# Altium schematic sheet guitar_tuner.SchDoc
size Letter
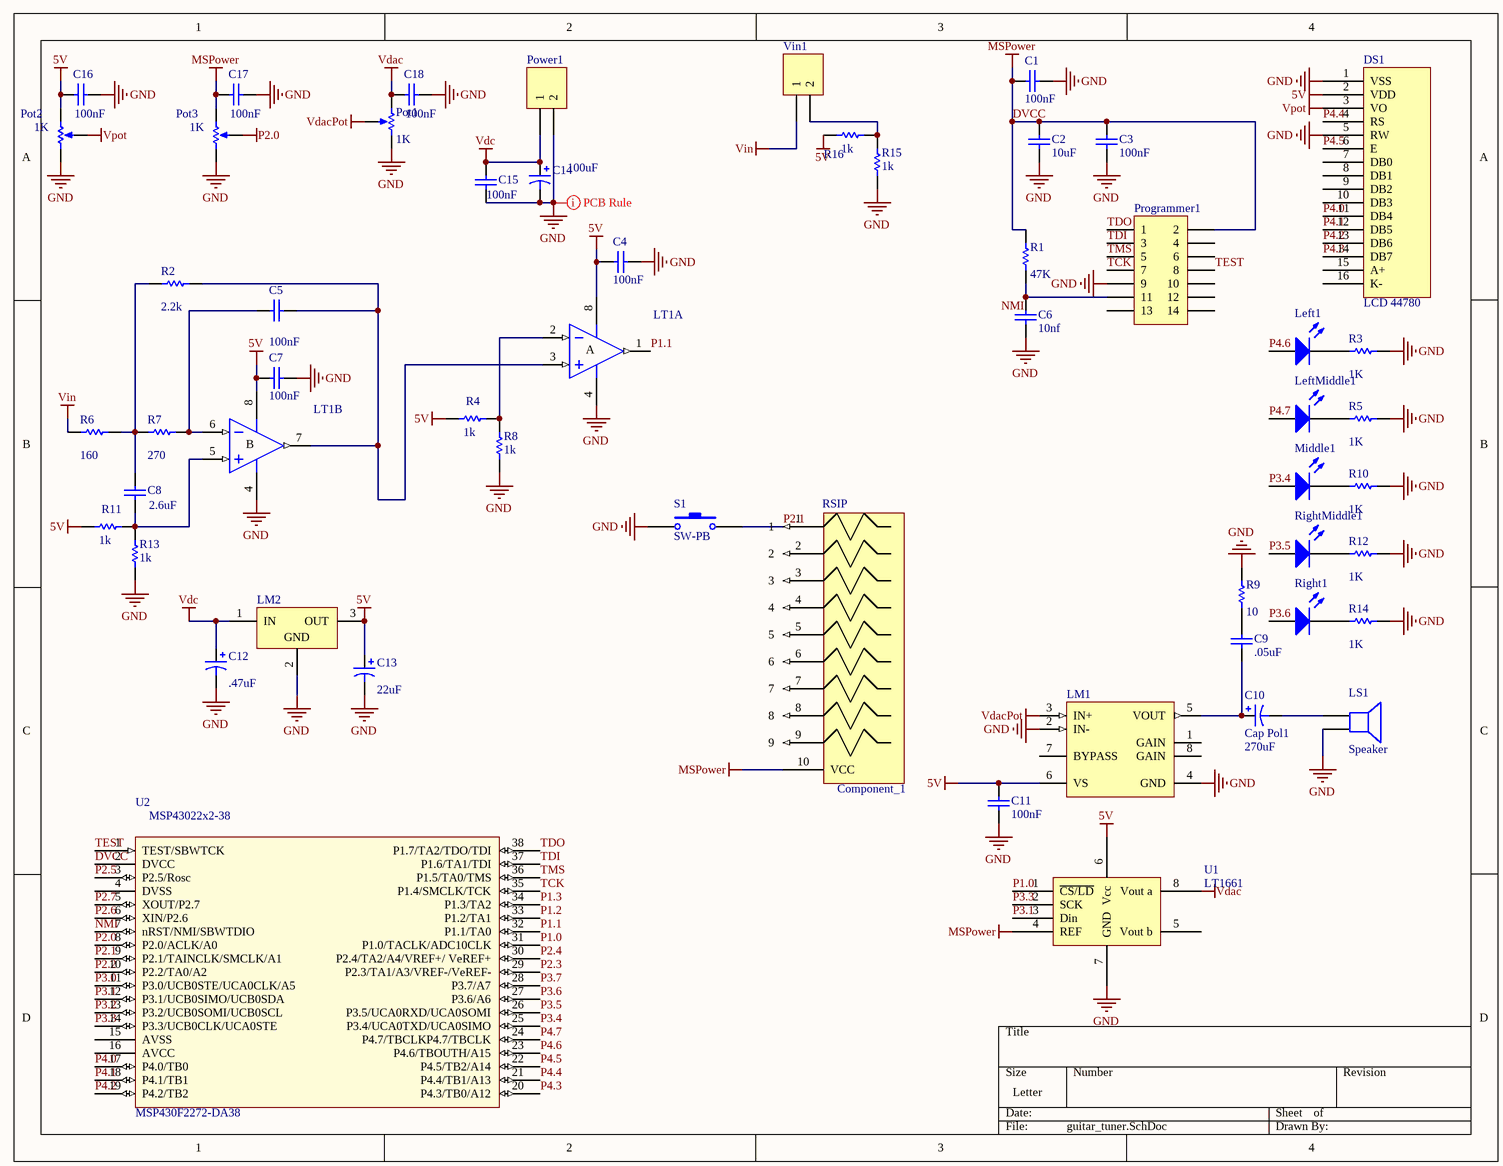
[diagram p0: guitar_tuner.SchDoc]

## Parts
C1  value 100nF  [RAD-0.1]  (hidden comment: Cap)
C2  value 10uF  [RAD-0.1]  (hidden comment: Cap)
C3  value 100nF  [RAD-0.1]  (hidden comment: Cap)
C4  value 100nF  [RAD-0.1]  (hidden comment: Cap)
C5  value 100nF  [RAD-0.1]  (hidden comment: Cap)
C6  value 10nf  [RAD-0.1]  (hidden comment: Cap)
C7  value 100nF  [RAD-0.1]  (hidden comment: Cap)
C8  value 2.6uF  [RAD-0.1]  (hidden comment: Cap)
C9  value .05uF  [RAD-0.1]  (hidden comment: Cap)
C10  Cap Pol1  value 270uF  [CAPR5-4X5]
C11  value 100nF  [RAD-0.1]  (hidden comment: Cap)
C12  value .47uF  [CAPR5-4X5]  (hidden comment: Cap Pol1)
C13  value 22uF  [CAPR5-4X5]  (hidden comment: Cap Pol1)
C14  value 100uF  [CAPR5-4X5]  (hidden comment: Cap Pol1)
C15  value 100nF  [RAD-0.1]  (hidden comment: Cap)
C16  value 100nF  [RAD-0.1]  (hidden comment: Cap)
C17  value 100nF  [RAD-0.1]  (hidden comment: Cap)
C18  value 100nF  [RAD-0.1]  (hidden comment: Cap)
DS1  LCD 44780  [OLED 16x2]
Left1  LED1  [LED-1]  (value not drawn)
LeftMiddle1  LED1  [LED-1]  (value not drawn)
LM1  LM386N-1  [N08E]  (value not drawn)
LM2  LM330KC  [KC03]  (value not drawn)
LS1  Speaker  [PIN2]
LT1  LF353P  [P008]  (value not drawn)  (parts A,B of 2)
Middle1  LED1  [LED-1]  (value not drawn)
Pot1  value 1K  [VR5]  (hidden comment: RPot)
Pot2  value 1K  [VR5]  (hidden comment: RPot)
Pot3  value 1K  [VR5]  (hidden comment: RPot)
Power1  Power  [HDR1X2]  (value not drawn)
Programmer1  Header 7X2  [HDR2X7]  (value not drawn)
R1  value 47K  [AXIAL-0.3]  (hidden comment: Res1)
R2  value 2.2k  [AXIAL-0.3]  (hidden comment: Res1)
R3  value 1K  [AXIAL-0.3]  (hidden comment: Res1)
R4  value 1k  [AXIAL-0.3]  (hidden comment: Res1)
R5  value 1K  [AXIAL-0.3]  (hidden comment: Res1)
R6  value 160  [AXIAL-0.3]  (hidden comment: Res1)
R7  value 270  [AXIAL-0.3]  (hidden comment: Res1)
R8  value 1k  [AXIAL-0.3]  (hidden comment: Res1)
R9  value 10  [AXIAL-0.3]  (hidden comment: Res1)
R10  value 1K  [AXIAL-0.3]  (hidden comment: Res1)
R11  value 1k  [AXIAL-0.3]  (hidden comment: Res1)
R12  value 1K  [AXIAL-0.3]  (hidden comment: Res1)
R13  value 1k  [AXIAL-0.3]  (hidden comment: Res1)
R14  value 1K  [AXIAL-0.3]  (hidden comment: Res1)
R15  value 1k  [AXIAL-0.3]  (hidden comment: Res1)
R16  value 1k  [AXIAL-0.3]  (hidden comment: Res1)
Right1  LED1  [LED-1]  (value not drawn)
RightMiddle1  LED1  [LED-1]  (value not drawn)
RSIP  Component_1  [LTC1661]
S1  SW-PB  [SW PB]
U1  LT1661  [DIP-8]
U2  MSP430F2272-DA38  [DIP38]
Vin1  GuitarIn  [HDR1X2]  (value not drawn)

## Nets
5V: C4.2 C7.1 C11.1 C13.1 C16.1 DS1.2(VDD) LM1.6(VS) LM2.3(OUT) LT1.8(V+) Pot2.1(TOP) R4.1 R11.1 R16.1 U1.6(Vcc)
DVCC: C1.2 C2.1 C3.1 C17.1 Pot3.3(TAP) Programmer1.2 R1.2 RSIP.10(VCC) U1.4(REF) U2.2(DVCC)  [also labelled MSPower]
GND: C1.1 C2.2 C3.2 C4.1 C6.2 C7.2 C11.2 C12.2 C13.2 C14.2 C15.1 C16.2 C17.2 C18.2 DS1.1(VSS) DS1.5(RW) LM1.2(IN-) LM1.4(GND) LM2.2(GND) LS1.2 LT1.4(V-) Pot1.2(BOT) Pot2.3(TAP) Pot3.1(TOP) Power1.2 Programmer1.9 R3.2 R5.2 R8.1 R9.2 R10.2 R12.2 R13.1 R14.2 R15.1 S1.1 U1.7(GND)
P2.0: Pot3.2(BOT) U2.8(P2.0/ACLK/A0)
Vdac: C18.1 Pot1.1(TOP) U1.8(Vout_a)
VdacPot: LM1.3(IN+) Pot1.3(TAP)
Vdc: C12.1 C14.1 C15.2 LM2.1(IN) Power1.1
Vin: R6.1 Vin1.1
Vpot: DS1.3(VO) Pot2.2(BOT)
NMI: C6.1 Programmer1.11 R1.1 U2.7(nRST/NMI/SBWTDIO)
P1.0: U1.1(~{CS/LD}) U2.31(P1.0/TACLK/ADC10CLK)
P1.1: LT1.1(OUT) U2.32(P1.1/TA0)
P1.2: U2.33(P1.2/TA1)
P1.3: U2.34(P1.3/TA2)
P2.1: S1.2 U2.9(P2.1/TAINCLK/SMCLK/A1)
P2.2: U2.10(P2.2/TA0/A2)
P2.3: U2.29(P2.3/TA1/A3/VREF-/VeREF-)
P2.4: U2.30(P2.4/TA2/A4/VREF+/_VeREF+)
P2.5: U2.3(P2.5/Rosc)
P2.6: U2.6(XIN/P2.6)
P2.7: U2.5(XOUT/P2.7)
P3.0: U2.11(P3.0/UCB0STE/UCA0CLK/A5)
P3.1: U1.3(Din) U2.12(P3.1/UCB0SIMO/UCB0SDA)
P3.2: U2.13(P3.2/UCB0SOMI/UCB0SCL)
P3.3: U1.2(SCK) U2.14(P3.3/UCB0CLK/UCA0STE)
P3.4: Middle1.1(A) U2.25(P3.4/UCA0TXD/UCA0SIMO)
P3.5: RightMiddle1.1(A) U2.26(P3.5/UCA0RXD/UCA0SOMI)
P3.6: Right1.1(A) U2.27(P3.6/A6)
P3.7: U2.28(P3.7/A7)
P4.0: DS1.11(DB4) U2.17(P4.0/TB0)
P4.1: DS1.12(DB5) U2.18(P4.1/TB1)
P4.2: DS1.13(DB6) U2.19(P4.2/TB2)
P4.3: DS1.14(DB7) U2.20(P4.3/TB0/A12)
P4.4: DS1.4(RS) U2.21(P4.4/TB1/A13)
P4.5: DS1.6(E) U2.22(P4.5/TB2/A14)
P4.6: Left1.1(A) U2.23(P4.6/TBOUTH/A15)
P4.7: LeftMiddle1.1(A) U2.24(P4.7/TBCLKP4.7/TBCLK)
TCK: Programmer1.7 U2.35(P1.4/SMCLK/TCK)
TDI: Programmer1.3 U2.37(P1.6/TA1/TDI)
TDO: Programmer1.1 U2.38(P1.7/TA2/TDO/TDI)
TEST: Programmer1.8 U2.1(TEST/SBWTCK)
TMS: Programmer1.5 U2.36(P1.5/TA0/TMS)
NetC5_1: C5.1 LT1.6(IN-) R7.2
NetC5_2: C5.2 LT1.3(IN+) LT1.7(OUT) R2.2
NetC8_1: C8.1 LT1.5(IN+) R11.2 R13.2
NetC8_2: C8.2 R2.1 R6.2 R7.1
NetC9_1: C9.1 R9.1
NetC9_2: C9.2 C10.1 LM1.5(VOUT)
NetC10_2: C10.2 LS1.1
NetLeft1_2: Left1.2(K) R3.1
NetLeftMiddle1_2: LeftMiddle1.2(K) R5.1
NetLT1_2: LT1.2(IN-) R4.2 R8.2
NetMiddle1_2: Middle1.2(K) R10.1
NetR12_1: R12.1 RightMiddle1.2(K)
NetR14_1: R14.1 Right1.2(K)
NetR15_2: R15.2 R16.2 Vin1.2

Not connected (* = marked no-connect by the designer): DS1 7(DB0) 8(DB1) 9(DB2) 10(DB3) 15(A+) 16(K-); LM1 1(GAIN) 7(BYPASS) 8(GAIN); Programmer1 4 6 10 12 13 14; RSIP 1 2 3 4 5 6 7 8 9; U1 5(Vout_b); U2 4(DVSS) 15(AVSS) 16(AVCC)

## Layout directives
rule Width Constraint [Pref Width = 25mil    Min Width = 20mil    Max Width = 30mil]: GND

## Notes on the sheet
- (in symbol LF353P, part A) A
- (in symbol LF353P, part B) B
- (in symbol MSP430F22x2-DA38) MSP43022x2-38

## Library data of the parts
C1-C9 C11 C15-C18 = Cap: Capacitor; Published: 8-Jun-2000; LatestRevisionDate: 17-Jul-2002; LatestRevisionNote: Re-released for DXP Platform.; PackageReference: RAD-0.3; Publisher: Altium Limited; PackageDescription: Radial Cap, Thru-Hole; 2 Leads; 0.3 in Pin Spacing
C10 C12-C14 = Cap Pol1: Polarized Capacitor (Radial); Published: 8-Jun-2000; LatestRevisionDate: 17-Jul-2002; LatestRevisionNote: Re-released for DXP Platform.; PackageReference: RB7.6-15; Publisher: Altium Limited; PackageDescription: Polarized Capacitor (Radial); 2 Leads
Left1 LeftMiddle1 Middle1 Right1 RightMiddle1 = LED1: Typical RED GaAs LED; Published: 8-Jun-2000; LatestRevisionDate: 08-Jul-2005; LatestRevisionNote: Mech Layer 1 removed.; PackageReference: LED-1; Publisher: Altium Limited; PackageDescription: LED; 2 Leads
LM1 = LM386N-1: Low Voltage Audio Power Amplifier, 8-pin MDIP; Manufacturer: National Semiconductor; PackageTopMarking: NSUZXYTTE#*LM*386N-1; PowerWise: N; CompType: Audio IC; Published: 4-Dec-2008; DatasheetVersion: Aug-2000; PackageVersion: revG, May-2006; PackageReference: N08E; Publisher: Altium Limited; PackageDescription: MDIP, .365 x .250 x .130in, 8 Lead, .100in Pitch; Supplier 1: Farnell; Supplier Part Number 1: 9488332; PartNumber: LM386N-1; RoHS: N; PinCount: 8; Code_JEDEC: MS-001-BA; ComponentLink1Description: LM386 Datasheet; ComponentLink1URL: http://www.national.com/ds/LM/LM386.pdf; ComponentLink2Description: LM386 Web Page; ComponentLink2URL: http://www.national.com/pf/LM/LM386.html; ComponentLink3Description: N08E Package Page; ComponentLink3URL: http://www.national.com/packaging/folders/n08e.html
LM2 = LM330KC: 3-Terminal Positive Regulator; Note: Pin 2 is electrically connected to tab; Published: 15-Apr-2002; DatasheetVersion: Apr-1988; PackageVersion: Sep-1995; PackageReference: KC03; Publisher: Altium Limited; PackageDescription: TO, Thru-Hole, Vertical, Heatsink Mounted; 3 In-Line Leads; Pitch 2.54 mm; ComponentLink1Description: Manufacturer Link; ComponentLink1URL: http://www.ti.com/
LS1 = Speaker: Loudspeaker; Published: 24-Mar-1999; LatestRevisionDate: 17-Jul-2002; LatestRevisionNote: Re-released for DXP Platform.; PackageReference: PIN2; Publisher: Altium Limited
LT1 = LF353P: Dual Operational Amplifier; Published: 16-Jan-2001; LatestRevisionDate: 04-Mar-2005; LatestRevisionNote: Stylized 3D Model Added.; DatasheetVersion: Aug-1994; PackageVersion: Jun-1999; PackageReference: P008; Publisher: Altium Limited; PackageDescription: DIP; 8 Leads; Row Spacing 7.62 mm; Pitch 2.54 mm; Code_JEDEC: MO-001-AN; ComponentLink1Description: Manufacturer Link; ComponentLink1URL: http://www.ti.com/; ComponentLink2Description: Datasheet; ComponentLink2URL: http://www-s.ti.com/sc/ds/lf353.pdf
Pot1-Pot3 = RPot: Potentiometer; Sim Note: Enter the Resistance value and the set point into parameter fields.; Set Position: 0.5; Published: 8-Jun-2000; LatestRevisionDate: 17-Jul-2002; LatestRevisionNote: Re-released for DXP Platform.; PackageReference: VR5; Publisher: Altium Limited; PackageDescription: Variable Resistor, Thru-Hole; 3 Leads
Power1 Vin1 = Header 2: Header, 2-Pin; LatestRevisionDate: 17-Jul-2002; LatestRevisionNote: Re-released for DXP Platform.; Publisher: Altium Limited
Programmer1 = Header 7X2: Header, 7-Pin, Dual row; LatestRevisionDate: 17-Jul-2002; LatestRevisionNote: Re-released for DXP Platform.; Publisher: Altium Limited
R1-R16 = Res1: Resistor; Published: 8-Jun-2000; LatestRevisionDate: 17-Jul-2002; LatestRevisionNote: Re-released for DXP Platform.; PackageReference: AXIAL-0.3; Publisher: Altium Limited; PackageDescription: Axial Device, Thru-Hole; 2 Leads; 0.3 in Pin Spacing
S1 = SW-PB: DIGIKEY SW400-ND; Published: 24-Mar-1999; LatestRevisionDate: 17-Jul-2002; LatestRevisionNote: Re-released for DXP Platform.; Publisher: Altium Limited
U2 = MSP430F22x2-DA38: Supplier 1: Digi-Key; Supplier Part Number 1: 296-21456-1-ND